# Altium schematic sheet DC12V_IN.SchDoc
size A4
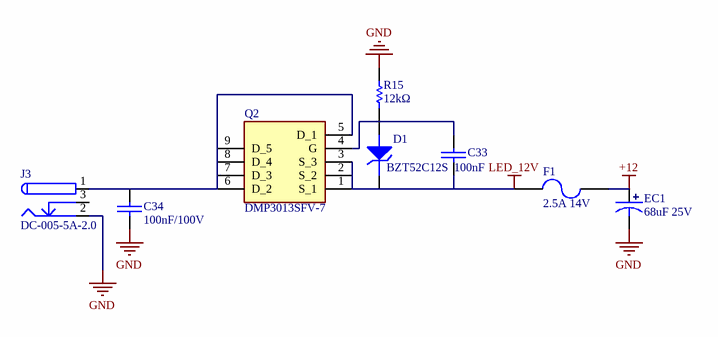
[diagram p0: DC12V_IN.SchDoc]

## Parts
C33  100nF  [C_0603]
C34  100nF/100V  [C_0603]
D1  BZT52C12S  [SOD-323]
EC1  68uF 25V  [SMD-EC6.3X6.3X10]
F1  2.5A 14V  [Fuse_1812]
J3  DC-005-5A-2.0  [DC-005]
Q2  DMP3013SFV-7  [DMP3013SFV7]
R15  12kΩ  [R_0402]

## Nets
+12: EC1.1 F1.2
GND: C34.1 EC1.2 J3.2 R15.1
LED_12V: C33.1 D1.K F1.1 Q2.1(S_1) Q2.2(S_2) Q2.3(S_3)
NetC33_2: C33.2 D1.A Q2.4(G) R15.2
NetC34_2: C34.2 J3.1 Q2.5(D_1) Q2.6(D_2) Q2.7(D_3) Q2.8(D_4) Q2.9(D_5)

Not connected (* = marked no-connect by the designer): J3 3

## Library data of the parts
C33 C34 = Cap_Chip: 贴片电容; Manufacturer_Name: *; Manufacturer_Part_Number: *
D1 = Diode_Zener: 稳压二极管; Manufacturer_Name: YONGYUTAI(永裕泰); Manufacturer_Part_Number: BZT52C12S; LCSC: C2891797
EC1 = Cap_E_SMD: 贴片电解电容; Manufacturer_Name: lelon(台湾立隆); Manufacturer_Part_Number: VZH680M1ETR-0606; LCSC: C249947
F1 = FUSE_PTC: 自恢复贴片保险丝; Manufacturer_Name: TLC(竞沃); Manufacturer_Part_Number: TLC-MSMD250/14; LCSC: C381482
J3 = DC-Socket: DC电源座子; Manufacturer_Name: XKB Connectivity(中国星坤); Manufacturer_Part_Number: DC-005-5A-2.0; LCSC: C381116
Q2 = DMP3013SFV-7: MOSFET (P-Channel); Manufacturer_Name: ALLPOWER(铨力); Manufacturer_Part_Number: AP15P03Q; Manufacturer_Name_1: Diodes Inc.; Manufacturer_Part_Number_1: DMP3013SFV-7(DMP3013SFV-3); LCSC: C471910
R15 = Res_Chip: 贴片电阻; Manufacturer_Name: *; Manufacturer_Part_Number: *